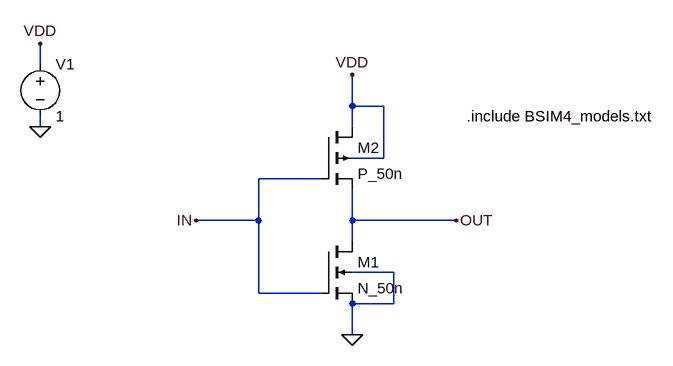
[diagram p0: schematic CMOS_Inverter.asc]
CMOS_Inverter.asc, the LTspice schematic file:
Version 4
SHEET 1 880 680
WIRE -224 -112 -224 -144
WIRE 256 -48 256 -96
WIRE 304 -48 256 -48
WIRE -224 -16 -224 -32
WIRE 256 -16 256 -48
WIRE 304 32 304 -48
WIRE 304 32 256 32
WIRE 208 64 112 64
WIRE 112 128 112 64
WIRE 112 128 16 128
WIRE 256 128 256 80
WIRE 416 128 256 128
WIRE 256 160 256 128
WIRE 320 208 256 208
WIRE 112 240 112 128
WIRE 208 240 112 240
WIRE 320 256 320 208
WIRE 320 256 256 256
WIRE 256 304 256 256
FLAG 256 304 0
FLAG -224 -16 0
FLAG -224 -144 VDD
FLAG 256 -96 VDD
FLAG 16 128 IN
FLAG 416 128 OUT
SYMBOL nmos4 208 160 R0
SYMATTR InstName M1
SYMATTR Value N_50n
SYMATTR Value2 l=50n w=500n
SYMBOL pmos4 208 -16 R0
SYMATTR InstName M2
SYMATTR Value P_50n
SYMATTR Value2 l=50n w=1u
SYMBOL voltage -224 -128 R0
WINDOW 123 0 0 Left 0
WINDOW 39 0 0 Left 0
SYMATTR InstName V1
SYMATTR Value 1
TEXT 432 -32 Left 2 !.include BSIM4_models.txt

The netlist it stands for:
* CMOS_Inverter.asc
M1 OUT IN 0 0 N_50n l=50n w=500n
M2 VDD IN OUT VDD P_50n l=50n w=1u
V1 VDD 0 1
.model NMOS NMOS
.model PMOS PMOS
.lib standard.mos
.include BSIM4_models.txt
.backanno
.end